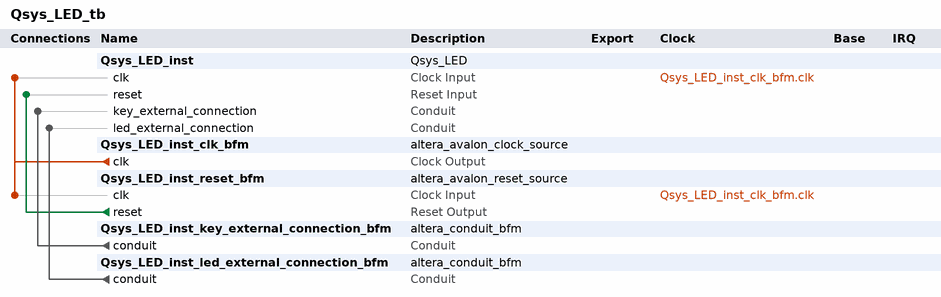
[diagram p0: system contents]
# Platform Designer (Qsys) system Qsys_LED_tb, Cyclone V 5CSEMA5F31C6
# Parameters at their usual value, and those the tool derives, are not listed.
package require -exact qsys 17.0
create_system Qsys_LED_tb
set_project_property DEVICE_FAMILY {Cyclone V}
set_project_property DEVICE 5CSEMA5F31C6

add_instance Qsys_LED_inst Qsys_LED 1.0

add_instance Qsys_LED_inst_clk_bfm altera_avalon_clock_source 17.0
set_instance_parameter_value Qsys_LED_inst_clk_bfm CLOCK_RATE 100000000

add_instance Qsys_LED_inst_reset_bfm altera_avalon_reset_source 17.0
set_instance_parameter_value Qsys_LED_inst_reset_bfm ASSERT_HIGH_RESET 0
set_instance_parameter_value Qsys_LED_inst_reset_bfm INITIAL_RESET_CYCLES 50

add_instance Qsys_LED_inst_key_external_connection_bfm altera_conduit_bfm 17.0
set_instance_parameter_value Qsys_LED_inst_key_external_connection_bfm CLOCKED_SIGNAL false
set_instance_parameter_value Qsys_LED_inst_key_external_connection_bfm ENABLE_RESET false
set_instance_parameter_value Qsys_LED_inst_key_external_connection_bfm SIGNAL_DIRECTIONS output
set_instance_parameter_value Qsys_LED_inst_key_external_connection_bfm SIGNAL_WIDTHS 1

add_instance Qsys_LED_inst_led_external_connection_bfm altera_conduit_bfm 17.0
set_instance_parameter_value Qsys_LED_inst_led_external_connection_bfm CLOCKED_SIGNAL false
set_instance_parameter_value Qsys_LED_inst_led_external_connection_bfm ENABLE_RESET false
set_instance_parameter_value Qsys_LED_inst_led_external_connection_bfm SIGNAL_DIRECTIONS input
set_instance_parameter_value Qsys_LED_inst_led_external_connection_bfm SIGNAL_WIDTHS 10

# connections
add_connection Qsys_LED_inst_clk_bfm.clk Qsys_LED_inst.clk clock
add_connection Qsys_LED_inst_clk_bfm.clk Qsys_LED_inst_reset_bfm.clk clock
add_connection Qsys_LED_inst_reset_bfm.reset Qsys_LED_inst.reset reset
add_connection Qsys_LED_inst_key_external_connection_bfm.conduit Qsys_LED_inst.key_external_connection conduit
add_connection Qsys_LED_inst_led_external_connection_bfm.conduit Qsys_LED_inst.led_external_connection conduit

set_interconnect_requirement {$system} qsys_mm.clockCrossingAdapter HANDSHAKE
set_interconnect_requirement {$system} qsys_mm.enableEccProtection FALSE
set_interconnect_requirement {$system} qsys_mm.insertDefaultSlave FALSE
set_interconnect_requirement {$system} qsys_mm.maxAdditionalLatency 1

save_system Qsys_LED_tb.qsys
